# Altium schematic sheet sd_debug.SchDoc: DevelBoard EVA01 MicroSD and Debug.
size A3; Author: Daniele Basile <asterix@develer.com>; Organization: Develer s.r.l.; Address1: via Mugellese 1/A; Address2: 50019 Campi Bisenzio; Address3: Firenze; Address4: ITALY; DocumentNumber: 3; Revision: B; SheetNumber: 3; SheetTotal: 6; Hw_rev: R2
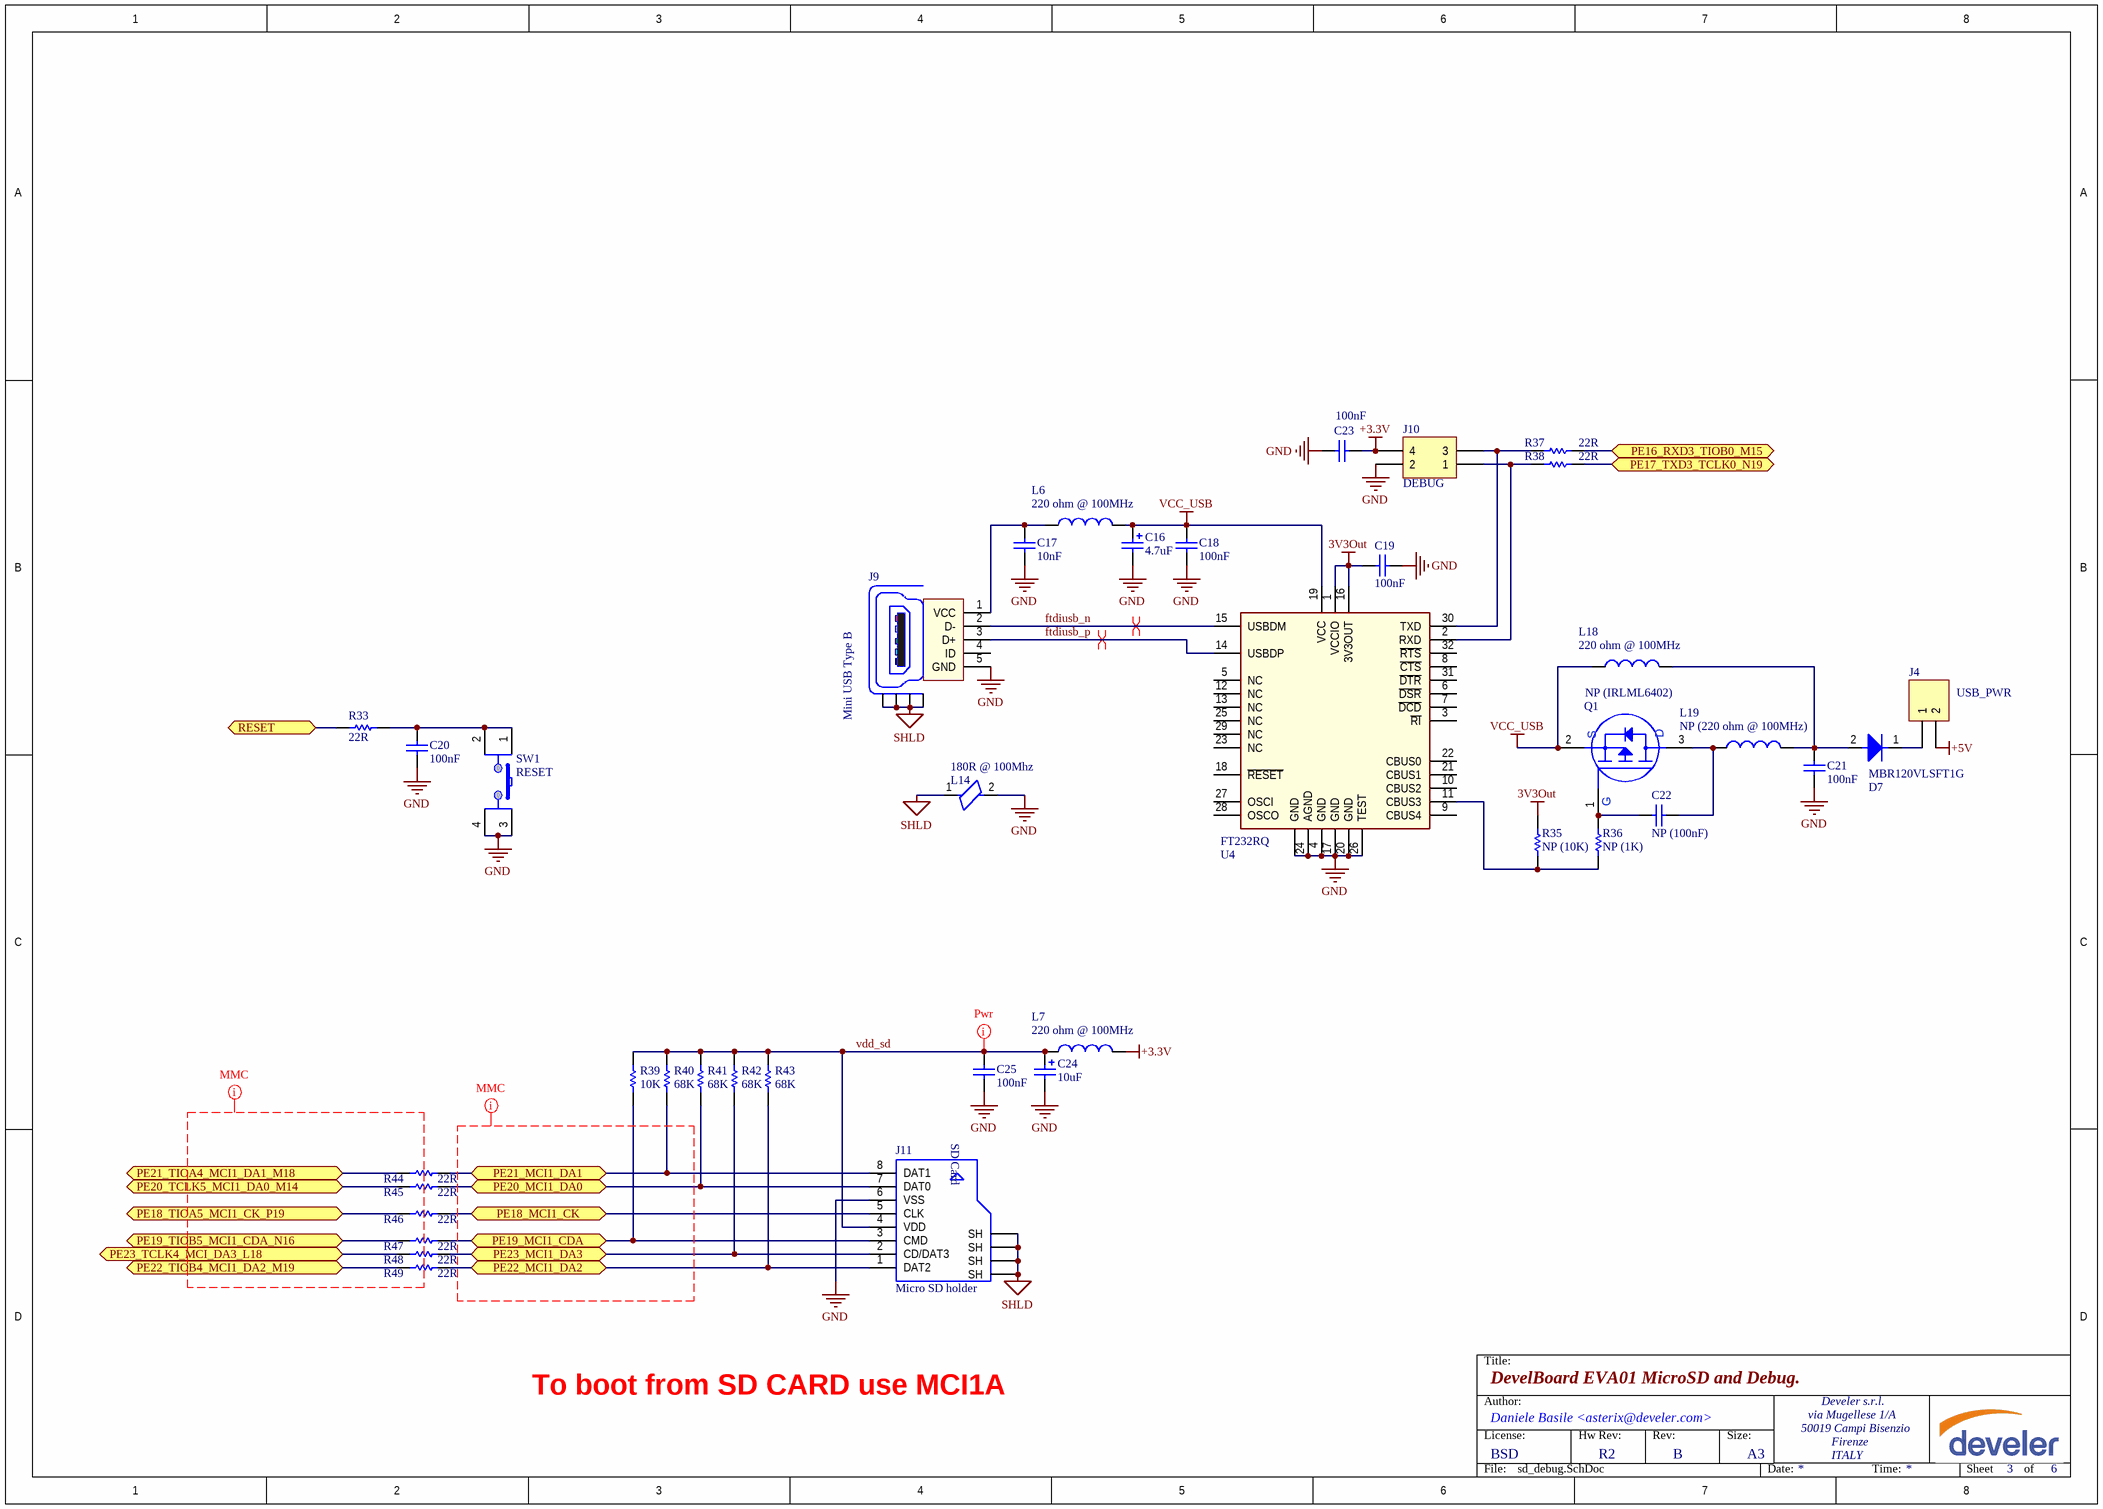
[diagram p0: sd_debug.SchDoc]

## Parts
C16  4.7uF  [1206_[3216]]
C17  10nF  [0603_[1608]]
C18  100nF  [0603_[1608]]
C19  100nF  [0603_[1608]]
C20  100nF  [0603_[1608]]
C21  100nF  [0603_[1608]]
C22  NP (100nF)  [0603_[1608]]
C23  100nF  [0603_[1608]]
C24  10uF  [1206_[3216]]
C25  100nF  [0603_[1608]]
D7  MBR120VLSFT1G  [SOD-123]
J4  USB_PWR  [HEADER_1X2_2.54MM_THD]
J9  Mini USB Type B  [usb_typeB_mini_smd]
J10  DEBUG  [HEADER_2X2_2.54MM_THD]
J11  Micro SD holder  [micro_sd_holder_pp]
L6  220 ohm @ 100MHz  [0805_[2012]]
L7  220 ohm @ 100MHz  [0805_[2012]]
L14  180R @ 100Mhz  [0603_[1608]]
L18  220 ohm @ 100MHz  [0805_[2012]]
L19  NP (220 ohm @ 100MHz)  [0805_[2012]]
Q1  NP (IRLML6402)  [SOT-23]
R33  22R  [0603_[1608]]
R35  NP (10K)  [0603_[1608]]
R36  NP (1K)  [0603_[1608]]
R37  22R  [0603_[1608]]
R38  22R  [0603_[1608]]
R39  10K  [0603_[1608]]
R40  68K  [0603_[1608]]
R41  68K  [0603_[1608]]
R42  68K  [0603_[1608]]
R43  68K  [0603_[1608]]
R44  22R  [0603_[1608]]
R45  22R  [0603_[1608]]
R46  22R  [0603_[1608]]
R47  22R  [0603_[1608]]
R48  22R  [0603_[1608]]
R49  22R  [0603_[1608]]
SW1  RESET  [TACTILE_SWITCH_6x6MM_SMD]
U4  FT232RQ  [QFN-32]

## Ports
PE16_RXD3_TIOB0_M15, PE17_TXD3_TCLK0_N19, PE18_MCI1_CK, PE18_TIOA5_MCI1_CK_P19, PE19_MCI1_CDA, PE19_TIOB5_MCI1_CDA_N16, PE20_MCI1_DA0, PE20_TCLK5_MCI1_DA0_M14, PE21_MCI1_DA1, PE21_TIOA4_MCI1_DA1_M18, PE22_MCI1_DA2, PE22_TIOB4_MCI1_DA2_M19, PE23_MCI1_DA3, PE23_TCLK4_MCI_DA3_L18, RESET

## Nets
3V3Out: C19.1 R35.1 U4.1(VCCIO) U4.16(3V3OUT)
+3.3V: C23.1 J10.4 L7.1
+5V: J4.2
GND: C16.2 C17.2 C18.2 C19.2 C20.1 C21.1 C23.2 C24.2 C25.2 J9.5(GND) J10.2 J11.6(VSS) L14.2 SW1.3 SW1.4 U4.4(GND) U4.17(GND) U4.20(GND) U4.24(AGND) U4.26(TEST) U4.GND_PAD(GND)
SHLD: J9.Z1(Shield) J9.Z2(Shield) J9.Z3(Shield) J9.Z4(Shield) J11.Z1(SH) J11.Z2(SH) J11.Z3(SH) J11.Z4(SH) L14.1
VCC_USB: C16.1 C18.1 L6.1 L18.2 Q1.2(S) U4.19(VCC)
ftdiusb_n: J9.2(D-) U4.15(USBDM)
ftdiusb_p: J9.3(D+) U4.14(USBDP)
PE16_RXD3_TIOB0_M15: R37.1 ; port PE16_RXD3_TIOB0_M15
PE17_TXD3_TCLK0_N19: R38.1 ; port PE17_TXD3_TCLK0_N19
PE18_MCI1_CK: J11.5(CLK) R46.2 ; port PE18_MCI1_CK
PE18_TIOA5_MCI1_CK_P19: R46.1 ; port PE18_TIOA5_MCI1_CK_P19
PE19_MCI1_CDA: J11.3(CMD) R39.2 R47.2 ; port PE19_MCI1_CDA
PE19_TIOB5_MCI1_CDA_N16: R47.1 ; port PE19_TIOB5_MCI1_CDA_N16
PE20_MCI1_DA0: J11.7(DAT0) R41.2 R45.2 ; port PE20_MCI1_DA0
PE20_TCLK5_MCI1_DA0_M14: R45.1 ; port PE20_TCLK5_MCI1_DA0_M14
PE21_MCI1_DA1: J11.8(DAT1) R40.2 R44.2 ; port PE21_MCI1_DA1
PE21_TIOA4_MCI1_DA1_M18: R44.1 ; port PE21_TIOA4_MCI1_DA1_M18
PE22_MCI1_DA2: J11.1(DAT2) R43.2 R49.2 ; port PE22_MCI1_DA2
PE22_TIOB4_MCI1_DA2_M19: R49.1 ; port PE22_TIOB4_MCI1_DA2_M19
PE23_MCI1_DA3: J11.2(CD/DAT3) R42.2 R48.2 ; port PE23_MCI1_DA3
PE23_TCLK4_MCI_DA3_L18: R48.1 ; port PE23_TCLK4_MCI_DA3_L18
RESET: R33.2 ; port RESET
vdd_sd: C24.1 C25.1 J11.4(VDD) L7.2 R39.1 R40.1 R41.1 R42.1 R43.1
NetC17_1: C17.1 J9.1(VCC) L6.2
NetC20_2: C20.2 R33.1 SW1.1 SW1.2
NetC21_2: C21.2 D7.2(A) L18.1 L19.1
NetC22_1: C22.1 Q1.1(G) R36.1
NetC22_2: C22.2 L19.2 Q1.3(D)
NetD7_1: D7.1(K) J4.1
NetJ10_1: J10.1 R38.2 U4.2(RXD)
NetJ10_3: J10.3 R37.2 U4.30(TXD)
NetR35_2: R35.2 R36.2 U4.11(CBUS3)

Not connected (* = marked no-connect by the designer): J9 4(ID); U4 3(~{RI}) 5(NC) 6(~{DSR}) 7(~{DCD}) 8(~{CTS}) 9(CBUS4) 10(CBUS2) 12(NC) 13(NC) 18(~{RESET}) 21(CBUS1) 22(CBUS0) 23(NC) 25(NC) 27(OSCI) 28(OSCO) 29(NC) 31(~{DTR}) 32(~{RTS})

## Layout directives
differential pair: ftdiusb_n, ftdiusb_p
net class mmc: (no net found under the mark)
net class mmc_con: (no net found under the mark)
net class Power: vdd_sd

## Notes on the sheet
- To boot from SD CARD use MCI1A
- Title:
- Author:
- License:
- BSD
- Hw Rev:
- Rev:
- Size:
- A3
- File:
- Date:
- Time:
- Sheet
- of
- (in symbol micro_sd_holde) SD Card

## Library data of the parts
C16 = Cap Pol1: Ceramic X5R 25V; Value: 10uF; Published: 8-Jun-2000; Revision: July-2002: Re-released for DXP Platform.; Publisher: Altium Limited
C17 = Cap: Ceramic X7R 50V; Published: 8-Jun-2000; Revision: July-2002: Re-released for DXP Platform.; Publisher: Altium Limited; Value: 10nF
C18-C23 = Cap: Ceramic X7R 50V; Value: 10nF; Published: 8-Jun-2000; Revision: July-2002: Re-released for DXP Platform.; Publisher: Altium Limited
C24 = Cap Pol1: Ceramic X5R 25V; Published: 8-Jun-2000; Revision: July-2002: Re-released for DXP Platform.; Publisher: Altium Limited; Value: 10uF
C25 = Cap: Ceramic X7R 50V; Value: 100pF; Published: 8-Jun-2000; LatestRevisionDate: 17-Jul-2002; LatestRevisionNote: Re-released for DXP Platform.; PackageReference: RAD-0.3; Publisher: Altium Limited; PackageDescription: Radial Cap, Thru-Hole; 2 Leads; 0.3 in Pin Spacing
D7 = Diode: Diode Schottky  low Vf, If 1A (PMEG3010ER; MBRX120LF)
J4 = Header 2: Pin Header, 2pin, 1x2, 2.54mm, THD; LatestRevisionDate: 17-Jul-2002; LatestRevisionNote: Re-released for DXP Platform.; Publisher: Altium Limited
J9 = USB_Con_Type_B_mini_SMT: Mini USB SMT Type B 5 Contacts (WE 65100516121); Manufacturer: Würth Elektronik eiSos GmbH; ComponentLink1 Description: Manufacturer; ComponentLink2 Description: Datasheet; NoPins: 5; ComponentLink1URL: http://www.we-online.de; ComponentLink2URL: http://katalog.we-online.de/em/datasheet/65100516121.pdf; Created by: Karrer Zheng; Created Date: 10/10/2014; partNo: 65100516121
J10 = Header 2X2: Pin Header, 4pin, 2x2, 2.54mm, THD; LatestRevisionDate: 17-Jul-2002; LatestRevisionNote: Re-released for DXP Platform.; Publisher: Altium Limited
J11 = micro_sd_holde: WR-CRD Micro SD_Push and Push (693071010811); Manufacturer: Würth Elektronik eiSos GmbH; ComponentLink1 Description: Manufacturer; ComponentLink2 Description: Datasheet; NoPins: 8; ComponentLink1URL: http://www.we-online.de; ComponentLink2URL: http://katalog.we-online.de/em/datasheet/693071010811.pdf; Created by: Karrer Zheng; Created Date: 10/10/2014; partNo: 693071010811
L6 L7 L18 L19 = Inductor: Ferrite Beat (WE 742792022)
L14 = BEAD_ FERRITE: Ferrite Beat (WE 7427927218)
Q1 = MOSFET-P 3pin: Mos N Channel
R33 R35 R37-R49 = Res1: Resistor; Value: 1K; Published: 8-Jun-2000; Revision: July-2002: Re-released for DXP Platform.; Publisher: Altium Limited
R36 = Res1: Resistor; Published: 8-Jun-2000; Revision: July-2002: Re-released for DXP Platform.; Publisher: Altium Limited; Value: 1K
SW1 = tactile_switch: Tactile switch smd H=4.3mm 10x6mm (like cod. Farnell 2435308)
U4 = FT232RQ: Serial TTL 232 <-> USB (QFN-32)